# Altium project PROJ4.PrjPcb
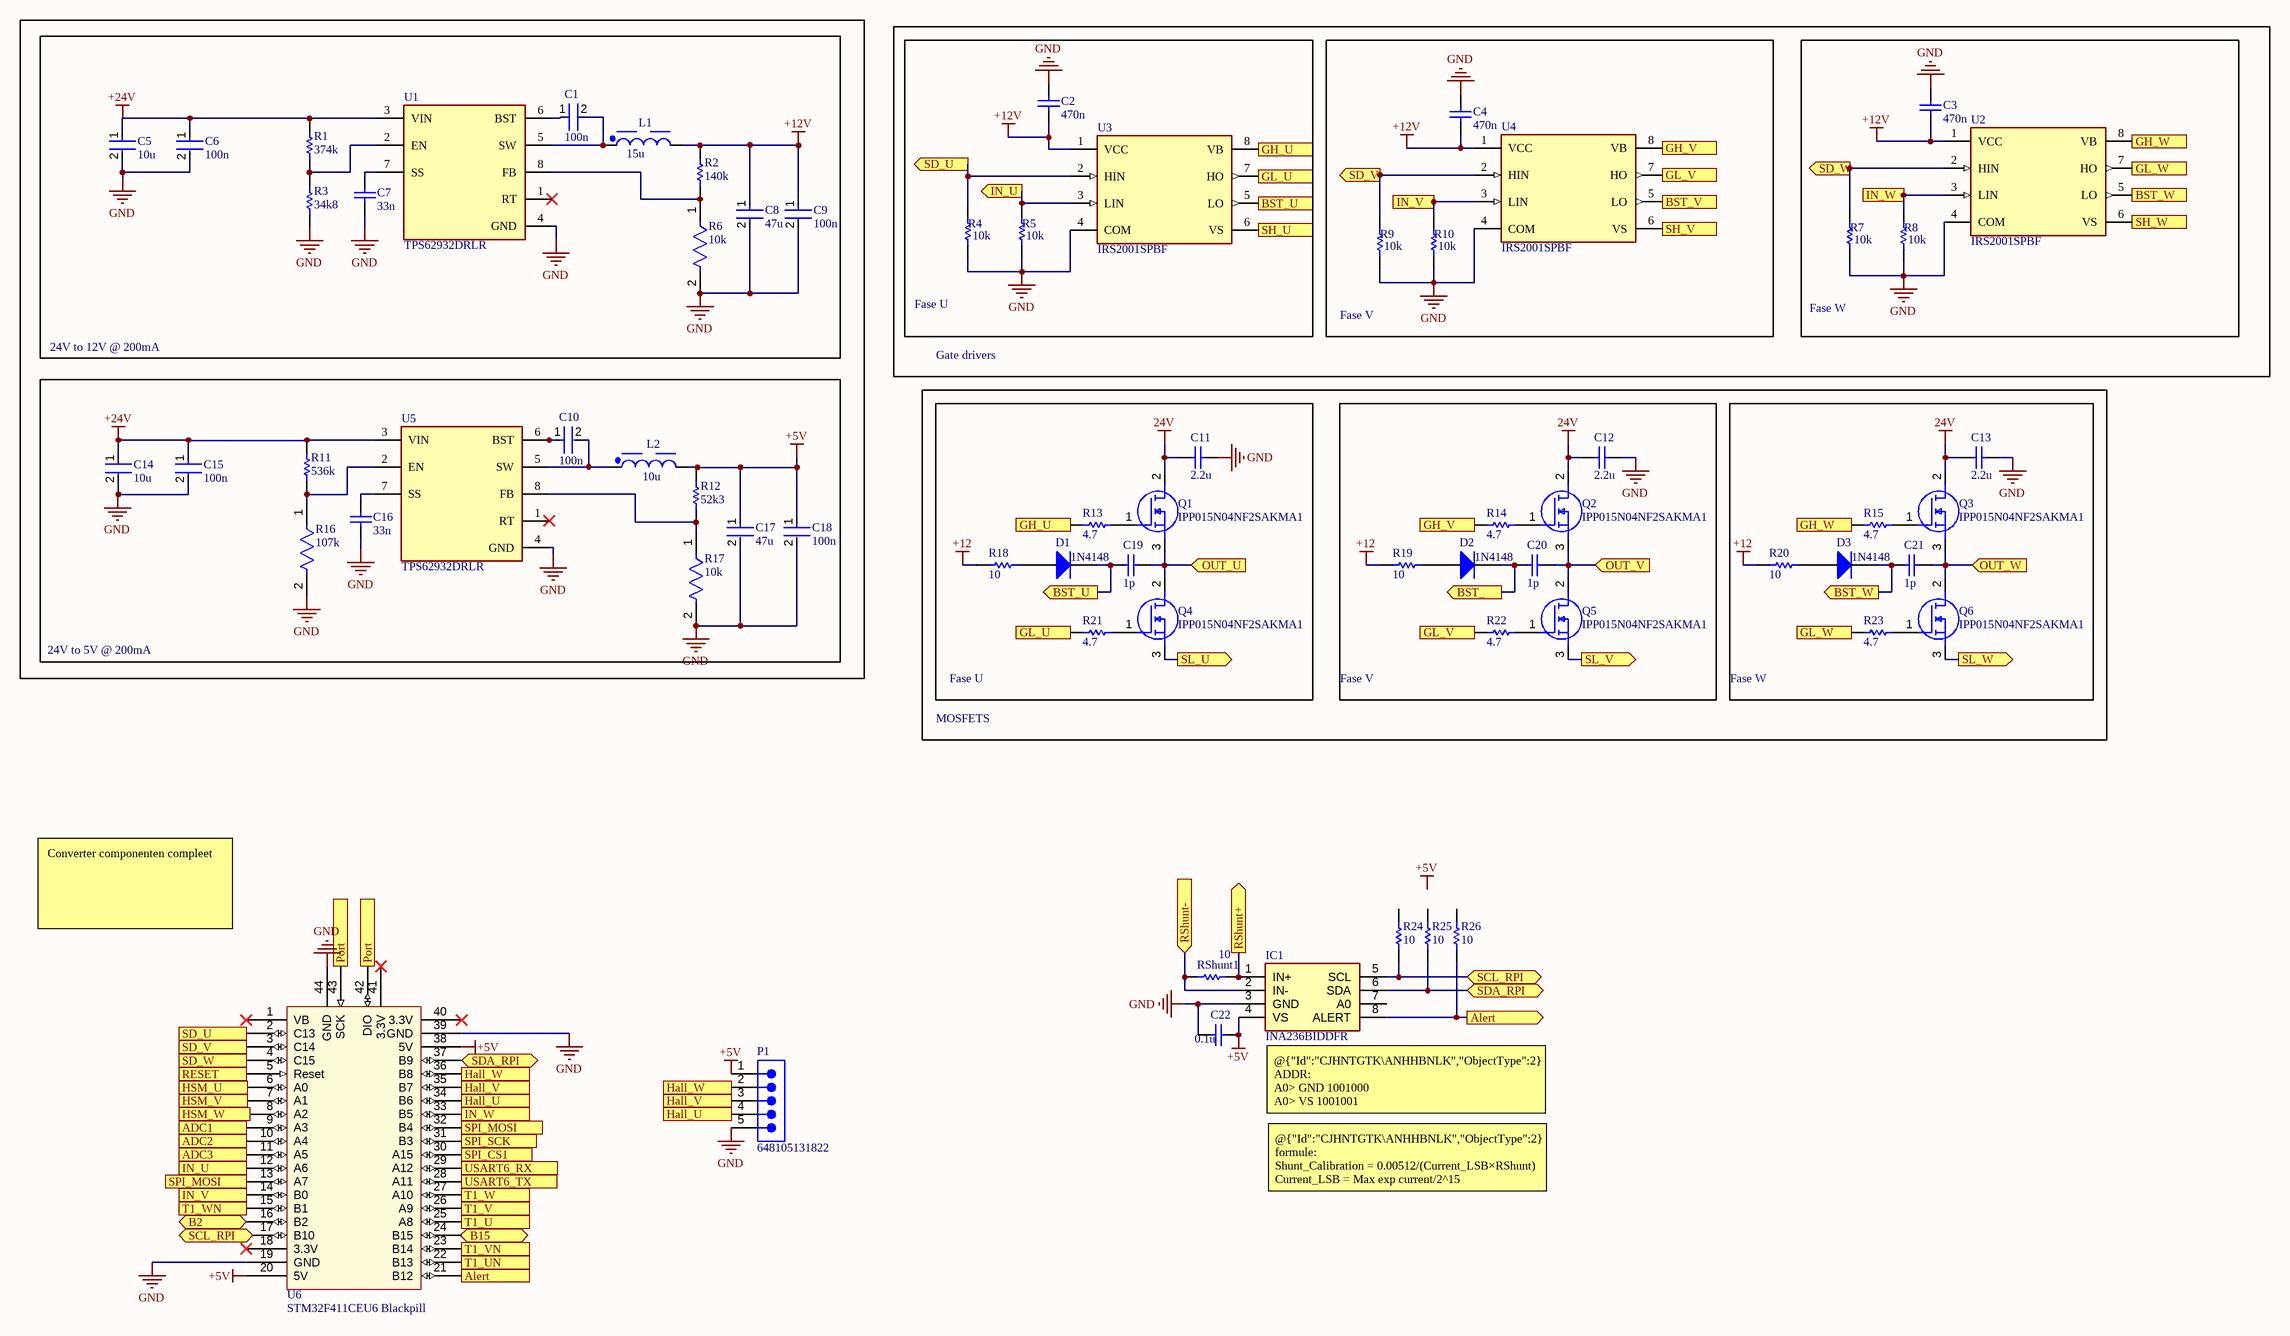
[diagram p0: Sheet1.SchDoc]
CAGE_CODE: ?????; CONTRACT_NUMBER: <CONTRACT NO>; DOC_NO_ASSY_DWG: <ASSY DWG NO>; DOC_NO_BOM: <BOM DOC NO>; DOC_NO_FAB_DWG: <FAB DWG NO>; DOC_NO_SCH_DWG: <SCH DWG NO>; PCB_2_DEC_TOL: +/-.01; PCB_3_DEC_TOL: +/-.010; PCB_ANG_TOL: +/-1/2; PCB_ASSEMBLY_NO: <PCB ASSY NO>; PCB_CHECKER: - -----; PCB_CHECKER_APP_DATE: --/--/----; PCB_DESIGNER: - -----; PCB_DESIGNER_APP_DATE: --/--/----; PCB_DWG_NO: <PCB DWG NO>; PCB_ENGINEER: - -----; PCB_ENGINEER_APP_DATE: --/--/----; PCB_PART_NUMBER: <PCB PN>; PCB_REV: A; SCH_REV: A
1 sheet, 68 parts. Net scope: flat (ports and power ports of the same name join across sheets).
Board file: PCB1.PcbDoc

## Sheet Sheet1.SchDoc: E-Bike controller
size C; Author: Laurens van der Drift; CompanyName: ALSET Innovations; DrawnBy: Laurens van der Drift; Engineer: Luuk van Kappel; Organization: De Haagse Hogeschool; SheetNumber: 1; SheetTotal: 1; ENG_APP_DATE: --/--/--; DSN_APP_DATE: --/--/--; CHK_APP_DATE: --/--/--

### Parts
C1  100n  [FP-CGA3E-0_3-0_1-IPC_A]
C2  value 470n  (hidden comment: Capacitor)
C3  value 470n  (hidden comment: Capacitor)
C4  value 470n  (hidden comment: Capacitor)
C5  10u  [FP-C3216-160-0_2-IPC_A]
C6  100n  [FP-CGA3E-0_3-0_1-IPC_A]
C7  33n  [CAPC1005X55X25NL05T10]
C8  47u  [FP-GRM32E-0_3-0_2-IPC_C]
C9  100n  [FP-CGA3E-0_3-0_1-IPC_A]
C10  100n  [FP-CGA3E-0_3-0_1-IPC_A]
C11  value 2.2u  (hidden comment: Capacitor)
C12  value 2.2u  (hidden comment: Capacitor)
C13  value 2.2u  (hidden comment: Capacitor)
C14  10u  [FP-C3216-160-0_2-IPC_A]
C15  100n  [FP-CGA3E-0_3-0_1-IPC_A]
C16  33n  [CAPC1005X55X25NL05T10]
C17  47u  [FP-GRM32E-0_3-0_2-IPC_C]
C18  100n  [FP-CGA3E-0_3-0_1-IPC_A]
C19  value 1p  (hidden comment: Capacitor)
C20  value 1p  (hidden comment: Capacitor)
C21  value 1p  (hidden comment: Capacitor)
C22  value 0.1u  (hidden comment: Capacitor)
D1  1N4148  [NXP-SOD27-2_V]
D2  1N4148  [NXP-SOD27-2_V]
D3  1N4148  [NXP-SOD27-2_V]
IC1  INA236BIDDFR  [SOT65P280X110-8N]
L1  15u  [WE-PD_1210]
L2  10u  [WE-PD_1210]
P1  648105131822  [648105131822]
Q1  IPP015N04NF2SAKMA1  [TO254P475X1028X1996-3P]
Q2  IPP015N04NF2SAKMA1  [TO254P475X1028X1996-3P]
Q3  IPP015N04NF2SAKMA1  [TO254P475X1028X1996-3P]
Q4  IPP015N04NF2SAKMA1  [TO254P475X1028X1996-3P]
Q5  IPP015N04NF2SAKMA1  [TO254P475X1028X1996-3P]
Q6  IPP015N04NF2SAKMA1  [TO254P475X1028X1996-3P]
R1  374k  [RESC1005X40X25ML05T05]
R2  140k  [RESC1609X50X30LL10T20]
R3  34k8  [RESC1005X40X25ML05T05]
R4  value 10k  (hidden comment: Resistor)
R5  value 10k  (hidden comment: Resistor)
R6  10k  [FP-CRCW0402-e3-IPC_B]
R7  value 10k  (hidden comment: Resistor)
R8  value 10k  (hidden comment: Resistor)
R9  value 10k  (hidden comment: Resistor)
R10  value 10k  (hidden comment: Resistor)
R11  536k  [RESC1005X40X25LL05T05]
R12  52k3  [RESC1608X55X25LL10T15]
R13  value 4.7  (hidden comment: Resistor)
R14  value 4.7  (hidden comment: Resistor)
R15  value 4.7  (hidden comment: Resistor)
R16  107k  [FP-CRCW0402-e3-IPC_A]
R17  10k  [FP-CRCW0402-e3-IPC_B]
R18  value 10  (hidden comment: Resistor)
R19  value 10  (hidden comment: Resistor)
R20  value 10  (hidden comment: Resistor)
R21  value 4.7  (hidden comment: Resistor)
R22  value 4.7  (hidden comment: Resistor)
R23  value 4.7  (hidden comment: Resistor)
R24  value 10  (hidden comment: Resistor)
R25  value 10  (hidden comment: Resistor)
R26  value 10  (hidden comment: Resistor)
RShunt1  value 10  (hidden comment: Resistor)
U1  TPS62932DRLR  [FP-DRL0008A-MFG]
U2  IRS2001SPBF  [FP-PG-DSO-8-MFG]
U3  IRS2001SPBF  [FP-PG-DSO-8-MFG]
U4  IRS2001SPBF  [FP-PG-DSO-8-MFG]
U5  TPS62932DRLR  [FP-DRL0008A-MFG]
U6  STM32F411CEU6 Blackpill  [STM32F411CEU6 Blackpill-Footprint-1]

### Blocks framed on the sheet
24V to 12V @ 200mA: C1 C5-C9 L1 R1-R3 R6 U1
Fase U: C2 R4 R5 U3
Fase V: C4 R9 R10 U4
Fase W: C3 R7 R8 U2
24V to 5V @ 200mA: C10 C14-C18 L2 R11 R12 R16 R17 U5
Fase U: C11 C19 D1 Q1 Q4 R13 R18 R21
Fase V: C12 C20 D2 Q2 Q5 R14 R19 R22
Fase W: C13 C21 D3 Q3 Q6 R15 R20 R23

### Ports
ADC1 (in), ADC2 (in), ADC3, Alert (in), Alert (out), B2 (bidir), B15 (bidir), BST_ (out), BST_U (out), BST_V (out), BST_W (out), GH_U (in), GH_U (out), GH_V (in), GH_V (out), GH_W (in), GH_W (out), GL_U (in), GL_U (out), GL_V (in), GL_V (out), GL_W (in), GL_W (out), Hall_U (in), Hall_U (out), Hall_V (in), Hall_V (out), Hall_W (in), Hall_W (out), HSM_U (in), HSM_V (in), HSM_W (in), IN_U (out), IN_V (out), IN_W (out), OUT_U (in), OUT_V (in), OUT_W (in), Port, RESET (in), RShunt+ (out), RShunt- (in), SCL_RPI (bidir), SD_U (out), SD_V (out), SD_W (out), SDA_RPI (bidir), SH_U (in), SH_V (in), SH_W (in), SL_U (out), SL_V (out), SL_W (out), SPI_CS1 (out), SPI_MOSI (in), SPI_MOSI (out), SPI_SCK (out), T1_U (out), T1_UN (out), T1_V (out), T1_VN (out), T1_W (out), T1_WN (out), USART6_RX (in), USART6_TX (out)

### Nets
24V: C11.1 C12.1 C13.1 Q1.2(D) Q2.2(D) Q3.2(D)
+5V: C17.1 C18.1 C22.2 IC1.4(VS) L2.2 P1.1 R12.2 U6.20(5V) U6.38(5V)
+12: R18.1 R19.1 R20.1
+12V: C2.2 C3.2 C4.2 C8.1 C9.1 L1.2 R2.1 U2.1(VCC) U3.1(VCC) U4.1(VCC)
+24V: C5.1 C6.1 C14.1 C15.1 R1.2 R11.2 U1.3(VIN) U5.3(VIN)
GND: C2.1 C3.1 C4.1 C5.2 C6.2 C7.1 C8.2 C9.2 C11.2 C12.2 C13.2 C14.2 C15.2 C16.1 C17.2 C18.2 C22.1 IC1.3(GND) P1.5 R3.1 R4.1 R5.1 R6.2 R7.1 R8.1 R9.1 R10.1 R16.2 R17.2 U1.4(GND) U2.4(COM) U3.4(COM) U4.4(COM) U5.4(GND) U6.19(GND) U6.39(GND) U6.44(GND)
NetC1_1: C1.1 U1.6(BST)
NetC1_2: C1.2 L1.1 U1.5(SW)
NetC7_2: C7.2 U1.7(SS)
NetC10_1: C10.1 U5.6(BST)
NetC10_2: C10.2 L2.1 U5.5(SW)
NetC16_2: C16.2 U5.7(SS)
NetC19_1: C19.1 D1.2(K) U3.5(LO) ; port BST_U
NetC19_2: C19.2 Q1.3(S) Q4.2(D) ; port OUT_U
NetC20_1: C20.1 D2.2(K) ; port BST_
NetC20_2: C20.2 Q2.3(S) Q5.2(D) ; port OUT_V
NetC21_1: C21.1 D3.2(K) U2.5(LO) ; port BST_W
NetC21_2: C21.2 Q3.3(S) Q6.2(D) ; port OUT_W
NetD1_1: D1.1(A) R18.2
NetD2_1: D2.1(A) R19.2
NetD3_1: D3.1(A) R20.2
NetIC1_1: IC1.1(IN+) RShunt1.1 ; port RShunt+
NetIC1_2: IC1.2(IN-) RShunt1.2 ; port RShunt-
NetIC1_5: IC1.5(SCL) R24.1 ; port SCL_RPI
NetIC1_6: IC1.6(SDA) R25.1 U6.37(B9) ; port SDA_RPI
NetIC1_8: IC1.8(ALERT) R26.1 U6.21(B12) ; port Alert
NetP1_2: P1.2 U6.36(B8) ; port Hall_W
NetP1_3: P1.3 U6.35(B7) ; port Hall_V
NetP1_4: P1.4 U6.34(B6) ; port Hall_U
NetQ1_1: Q1.1(G) R13.2
NetQ2_1: Q2.1(G) R14.2
NetQ3_1: Q3.1(G) R15.2
NetQ4_1: Q4.1(G) R21.2
NetQ4_3: Q4.3(S) ; port SL_U
NetQ5_1: Q5.1(G) R22.2
NetQ5_3: Q5.3(S) ; port SL_V
NetQ6_1: Q6.1(G) R23.2
NetQ6_3: Q6.3(S) ; port SL_W
NetR1_1: R1.1 R3.2 U1.2(EN)
NetR2_2: R2.2 R6.1 U1.8(FB)
NetR4_2: R4.2 U3.2(HIN) U6.2(C13) ; port SD_U
NetR5_2: R5.2 U3.3(LIN) U6.12(A6) ; port IN_U
NetR7_2: R7.2 U2.2(HIN) U6.4(C15) ; port SD_W
NetR8_2: R8.2 U2.3(LIN) U6.33(B5) ; port IN_W
NetR9_2: R9.2 U4.2(HIN) U6.3(C14) ; port SD_V
NetR10_2: R10.2 U4.3(LIN) U6.14(B0) ; port IN_V
NetR11_1: R11.1 R16.1 U5.2(EN)
NetR12_1: R12.1 R17.1 U5.8(FB)
NetR13_1: R13.1 U3.8(VB) ; port GH_U
NetR14_1: R14.1 U4.8(VB) ; port GH_V
NetR15_1: R15.1 U2.8(VB) ; port GH_W
NetR21_1: R21.1 U3.7(HO) ; port GL_U
NetR22_1: R22.1 U4.7(HO) ; port GL_V
NetR23_1: R23.1 U2.7(HO) ; port GL_W
NetU2_6: U2.6(VS) ; port SH_W
NetU3_6: U3.6(VS) ; port SH_U
NetU4_5: U4.5(LO) ; port BST_V
NetU4_6: U4.6(VS) ; port SH_V
NetU6_5: U6.5(Reset) ; port RESET
NetU6_9: U6.9(A3) ; port ADC1
NetU6_10: U6.10(A4) ; port ADC2
NetU6_11: U6.11(A5) ; port ADC3
NetU6_13: U6.13(A7) U6.32(B4) ; port SPI_MOSI
NetU6_15: U6.15(B1) ; port T1_WN
NetU6_16: U6.16(B2) ; port B2
NetU6_22: U6.22(B13) ; port T1_UN
NetU6_23: U6.23(B14) ; port T1_VN
NetU6_24: U6.24(B15) ; port B15
NetU6_25: U6.25(A8) ; port T1_U
NetU6_26: U6.26(A9) ; port T1_V
NetU6_27: U6.27(A10) ; port T1_W
NetU6_28: U6.28(A11) ; port USART6_TX
NetU6_29: U6.29(A12) ; port USART6_RX
NetU6_30: U6.30(A15) ; port SPI_CS1
NetU6_31: U6.31(B3) ; port SPI_SCK
NetU6_42: U6.42(DIO) U6.43(SCK) ; port Port

Not connected (* = marked no-connect by the designer): IC1 7(A0); R24 2; R25 2; R26 2; U1 1(RT)*; U5 1(RT)*; U6 1(VB)* 6(A0) 7(A1) 8(A2) 17(B10) 18(3.3V)* 40(3.3V)* 41(3.3V)*

### Notes on the sheet
- Gate drivers
- MOSFETS
- Converter componenten compleet
- @{"Id":"CJHNTGTK\ANHHBNLK","ObjectType":2} ADDR:
  A0> GND 1001000
  A0> VS 1001001
  A0> SDA 1001010
  A0> SCL 1001011
- @{"Id":"CJHNTGTK\ANHHBNLK","ObjectType":2} formule:
  Shunt_Calibration = 0.00512/(Current_LSB×RShunt)
  Current_LSB = Max exp current/2^15
  RShunt < Vsense_MAX/Imax
- Labels drawn without touching a wire or pin: +5V
- DWG. NO.
- REV.
- SHT.
- THIS DOCUMENT AND THE DATA DISCLOSED HEREIN OR HEREWITH IS THE PROPERTY OF ALTIUM LIMITED AND MAY BE FREELY DISTRIBUTED IN WHOLE. NO RIGHTS ARE RESERVED OR EXPRESS OR IMPLIED WARANTEE GIVEN.
- REVISION
- DESCRIPTION
- DATE
- APPROVED
- ENG:
- APPROVALS
- PROJECT
- DSN:
- CHK:
- REFERENCE DOCUMENTS
- PROJECT REVISION:
- TITLE
- DOCUMENT REVISION:
- DESIGN ITEM:
- BOM:
- FAB DWG:
- PCB DWG:
- ASSY DWG:
- SCALE:
- SIZE
- B
- CAGE CODE
- FILE NAME
- DWG NO.
- SHEET
- OF
- REV

### Library data of the parts
C1 C6 C9 C10 C15 C18 = CMP-2000-07546-2: Cap Ceramic 100nF 50V X7R 10% Pad SMD 0603 +125°C Automotive T/R / Fabrikantnr: CGA3E2X7R1H104K080AA; Weight: 7.1E-05oz; Composition: Ceramic; Max Operating Temperature: 125°C; Termination: SMD/SMT; Dielectric: X7R; Length: 1.6mm; Package Quantity: 1; REACH SVHC: No SVHC; Lead Free: Lead Free; Case Code (Metric): 1608; Min Operating Temperature: -55°C; Packaging: Tape and Reel; Tolerance: 10%; Voltage Rating: 50V; Case Code (Imperial): 0603; Capacitance: 100nF; Case/Package: 0603; Voltage Rating (DC): 50V; Depth: 0.8mm; Radiation Hardening: No; Ratings: AEC-Q200; Mount: Surface Mount; Voltage: 50V; Thickness: 0.035inch; Width: 0.8mm; Height: 0.8mm
C2-C4 C11-C13 C19-C22 = Capacitor: SimulationGenericComponent: True
C5 C14 = CMP-2000-06045-2: Multilayer Ceramic Capacitors 10uF ±10% 50V X5R SMD 1206 / Mouser Fabrikantnr: C3216X5R1H106K160AB; Min Operating Temperature: -55°C; Weight: 0.000571oz; Tolerance: 10%; Lead Free: Lead Free; REACH SVHC: No SVHC; Dielectric Material: Ceramic; Termination: SMD/SMT; Radiation Hardening: No; Case Code (Metric): 3216; Max Operating Temperature: 85°C; Voltage Rating (DC): 50V; Packaging: Tape and Reel; Height: 1.6mm; Voltage: 50V; Dielectric: X5R; Mount: Surface Mount; Voltage Rating: 50V; Capacitance: 10uF; Length: 3.2mm; RoHS Compliant: Yes; Thickness: 0.071inch; Depth: 1.6mm; Width: 0.063inch; Case/Package: 1206; Series: C; Package Quantity: 1; Resistor Type: Ceramic; Case Code (Imperial): 1206; Construction: Flat
C7 C16 = CMP-1034-01988-2: 33nF, 25VDC / Mouser Fabrikantnr: GRM155R71E333KA88D; Manufacturer: Murata; Part Number: GRM155R71E333KA88D
C8 C17 = CMP-2000-06362-2: CAP CER 47UF 16V X5R 1210 / Fabrikantnr: GRM32ER61C476KE15L; Tolerance: 10%; Material: Ceramic; Case Code (Metric): 3225; RoHS Compliant: Yes; Min Operating Temperature: -55°C; Radiation Hardening: No; Voltage: 16V; Package Quantity: 1; Case Code (Imperial): 1210; REACH SVHC: No SVHC; Capacitance: 47uF; Voltage Rating (DC): 16V; Dielectric: X5R; Case/Package: 1210; Length: 3.2mm; Voltage Rating: 16V; Packaging: Cut Tape; Width: 0.098inch; Number of Pins: 2; Lead Free: Lead Free; Height: 2.5mm; Mount: Surface Mount; Termination: SMD/SMT; Max Operating Temperature: 85°C; Thickness: 0.106inch; Depth: 2.5mm
D1-D3 = CMP-004-00000-2: High Speed Diode, 100 V, 0.45 A, -65 to 175 degC, 2-Pin SOD27, RoHS, Bulk; Manufacturer: Fairchild; Elements: 1; Recovery Time: 4ns; Forward Current: 300mA; Power: 500mW; Forward Voltage: 1V; Max Surge Current: 4A; Peak Reverse Current: 5uA; Datasheet URL: http://www.nxp.com/documents/data_sheet/1N4148_1N4448.pdf; Min Operating Temperature: -65°C; Manufacturer URL: https://www.fairchildsemi.com/; Packaging: Bulk; Diameter: 1.91mm; Pins: 2; Package URL: http://www.nxp.com/documents/data_sheet/1N4148_1N4448.pdf; Package Reference: SOD27; Max Operating Temperature: 175°C; Package Quantity: 2000; Case/Package: DO; Datasheet Version: Aug-04; RoHS Compliant: True
IC1 = INA236BIDDFR: Integrated Circuit; Manufacturer_Name: Texas Instruments; Datasheet Link: https://www.ti.com/general/docs/suppproductinfo.tsp?distId=26&gotoUrl=https://www.ti.com/lit/gpn/ina236; Height: 1.1mm; Manufacturer_Part_Number: INA236BIDDFR; Mouser Part Number: 595-INA236BIDDFR; Mouser Price/Stock: https://www.mouser.co.uk/ProductDetail/Texas-Instruments/INA236BIDDFR?qs=17ckDYBRdelpXu8anct71w%3D%3D
L1 = CMP-0227-00106-2: Vermogensinductoren - SMD WE-PD 15uH 6.5A / Mosuer Fabrikantnr: 7447709150; NexarPartId: 8917162; Series Resistance: 26mΩ; Inductance: 15µH; Test Frequency: 1kHz; Core Material: Ferrite; Tolerance: 20%; Shielding: Shielded; Self Resonant Frequency: 17MHz; DC Resistance (DCR): 21mΩ; Saturation Current: 8A; Case/Package: Nonstandard; Max DC Current: 6.5A; Composition: Wirewound; Case Code (Imperial): 1210; Width: 12mm; Termination: SMD/SMT; Resistance: 26mΩ; Max Operating Temperature: 125°C; Weight: 9.071847g; Min Operating Temperature: -40°C; Current Rating: 6.5A; Lead Free: Lead Free; Depth: 12mm; Mount: Surface Mount; Height - Seated (Max): 10.0076mm; Packaging: Cut Tape (CT); Case Code (Metric): 3225; Length: 12mm; Ambient Temperature Range High: 85°C; REACH SVHC: Unknown; Ambient Temperature Range Low: -40°C; Lead Pitch: 7mm; RoHS: Compliant; Number of Pins: 2; Inductance Tolerance: 20%; Height: 10mm; RMS Current (Irms): 6.5A
L2 = CMP-0227-00034-2: Vermogensinductoren - SMD WE-PD 10uH 7.1A / Fabrikantnr: 7447709100; NexarPartId: 21642419; Core Material: Ferrite; DC Resistance (DCR): 13mΩ; Test Frequency: 1kHz; Series Resistance: 21mΩ; Inductance: 10µH; Tolerance: 20%; Saturation Current: 10.5A; Self Resonant Frequency: 21MHz; Shielding: Shielded; Ambient Temperature Range Low: -40°C; Number of Pins: 2; Height - Seated (Max): 10.0076mm; Length: 12mm; Max Operating Temperature: 125°C; Max DC Current: 7.1A; Width: 12mm; Case Code (Metric): 3225; Composition: Wirewound; REACH SVHC: Unknown; Case/Package: Nonstandard; Packaging: Tape & Reel (TR); RoHS: Compliant; Current Rating: 7.1A; Min Operating Temperature: -40°C; Resistance: 21mΩ; Inductance Tolerance: 20%; Lead Pitch: 7mm; Case Code (Imperial): 1210; Height: 10mm; Ambient Temperature Range High: 85°C; Mount: Surface Mount; Weight: 4.535924g; Lead Free: Lead Free; Depth: 12mm; Termination: SMD/SMT; RMS Current (Irms): 7.1A
P1 = CMP-1502-00733-2: NexarPartId: 18818254; Number of Contacts: 5; Voltage Rating: 50V; Current Rating: 1A; Contact Resistance: 20mΩ; Gender: Male; Insulation Resistance: 500MΩ; Connector Type: Male Pin; Pitch: 1.5mm; Color: Beige, White; Number of Positions: 5; Lead Pitch: 1.5mm; Mount: Surface Mount; Contact Gender: Male; Contact Material: Copper; Flammability Rating: UL94 V-0; RoHS: Compliant; Packaging: Tape and Reel; REACH SVHC: Unknown; Housing Material: Nylon; Contact Plating: Tin; Height: 3.7mm; Max Operating Temperature: 85°C; Operating Supply Voltage: 50V; Number of Pins: 5; Termination: Solder; Min Operating Temperature: -25°C; Number of Rows: 1; Width: 10.5mm; Length: 10.5mm
Q1-Q6 = IPP015N04NF2SAKMA1: MOSFET (N-Channel); Manufacturer_Name: Infineon; Datasheet Link: https://www.mouser.it/datasheet/2/196/Infineon_IPP015N04NF2S_DataSheet_v02_00_EN-3164869.pdf; Height: 4.75mm; Manufacturer_Part_Number: IPP015N04NF2SAKMA1; Mouser Part Number: 726-IPP015N04NF2SAKM; Mouser Price/Stock: https://www.mouser.co.uk/ProductDetail/Infineon-Technologies/IPP015N04NF2SAKMA1?qs=By6Nw2ByBD2rHCf0vCszHQ%3D%3D; Arrow Part Number: IPP015N04NF2SAKMA1; Arrow Price/Stock: https://www.arrow.com/en/products/ipp015n04nf2sakma1/infineon-technologies-ag?region=nac
R1 = CMP-2002-08555-1: 374k / Fabrikantnr: / CRCW0402374KFKED; Manufacturer: Vishay Dale; Part Number: CRCW0402374KFKED
R2 = CMP-2000-03900-1: Mosuer Fabrikantnr: CRCW0603140KFKEA; Manufacturer: Vishay Dale; Part Number: CRCW0603140KFKEA
R3 = CMP-1011-00683-2: 34k8 / Fabrikantnr: / CRCW040234K8FKED; Manufacturer: Vishay Dale; Part Number: CRCW040234K8FKED
R4 R5 R7-R10 R13-R15 R18-R26 RShunt1 = Resistor: TC1: 0; SimulationGenericComponent: True; TC2: 0
R6 R17 = CMP-2002-08135-2: RES SMD 10K OHM 1% 1/16W 0402 / Fabrikantnr: CRCW040210K0FKED; Power Rating: 63mW; Resistance: 10kR; Voltage Rating: 50V; Temperature Coefficient: 100ppm/°C; Case Code (Metric): 1005; Features: Automotive AEC-Q200; Termination: SMD/SMT; Mount: Surface Mount; Package Quantity: 10; Packaging: Tape and Reel; Case Code (Imperial): 0402; Weight: 2.3E-05oz; Lead Free: Lead Free; Width: 0.02inch; Max Power Dissipation: 63mW; Tolerance: 1%; Number of Terminations: 2; Height: 0.35mm; Number of Pins: 2; Composition: Thick Film; Length: 1mm; Voltage Rating (DC): 50V; Case/Package: 0402; Radiation Hardening: No; Contact Plating: Tin; Depth: 0.5mm; Military Standard: Not; Min Operating Temperature: -55°C; Max Operating Temperature: 155°C
R11 = CMP-1011-00819-2: 536kohm / Mouser Fabrikantnr: CRCW0402536KFKED / CRCW0402536KFKED; Manufacturer: Vishay Dale; Part Number: CRCW0402536KFKED
R12 = CMP-1012-00705-2: Mouser Fabrikantnr: RC0603FR-0752K3L; Manufacturer: Yageo; Part Number: RC0603FR-0752K3L
R16 = CMP-2002-08133-2: RES Thick Film, 107kΩ, 1%, 0.063W, 100ppm/°C, 0402 / Fabrikantnr: / CRCW0402107KFKED; Max Power Dissipation: 63mW; Voltage Rating (DC): 50V; Resistance: 107kR; Case Code (Imperial): 0402; Features: Automotive AEC-Q200; Lead Free: Lead Free; Radiation Hardening: No; Case/Package: 0402; Max Operating Temperature: 155°C; Case Code (Metric): 1005; Depth: 0.5mm; Number of Terminations: 2; Temperature Coefficient: 100ppm/°C; Contact Plating: Tin; Height: 0.016inch; Tolerance: 1%; Weight: 2.3E-05oz; Min Operating Temperature: -55°C; Power Rating: 63mW; Packaging: Tape and Reel; Termination: SMD/SMT; Package Quantity: 10; Width: 0.02inch; Length: 1mm; Composition: Thick Film; Military Standard: Not; Number of Pins: 2; Voltage Rating: 50V
U1 U5 = CMP-04918-000714-1: 3.8-V TO 30-V INPUT, 2-A, 200-KH
U2-U4 = CMP-00196-65875172-1: IRS2001SPBF Cut Tape (CT) IRS2001SPBF Half-Bridge 1996 gate driver 100ns -40C~150C TJ 290mA 600mA 625mW; Channel Type: Independent; Operating Supply Current: 270µA; Turn-Off Delay Time: 150ns; Fall Time: 35ns; Number of Outputs: 2; Output Voltage: 220V; Nominal Supply Current: 150µA; Rise Time: 170ns; Propagation Delay: 220ns; Output Current: 130mA; Max Supply Voltage: 20V; Turn-On Delay Time: 160ns; Max Junction Temperature (Tj): 150°C; Min Supply Voltage: 10V; Mount: Surface Mount, Through Hole; Max Operating Temperature: 125°C; RoHS: Compliant; Ambient Temperature Range High: 125°C; Min Operating Temperature: -40°C; NexarPartId: 65875172; Number of Pins: 8; Lifecycle Status: NRND; Height: 1.4986mm; Package Quantity: 2500; Lead Free: Lead Free; Release Time: 150ns; Schedule B: 8542390000, 8542390000; Power Dissipation: 625mW; REACH SVHC: No SVHC; Width: 3.9878mm; Number of Channels: 2; Case/Package: DIP; Max Power Dissipation: 625mW; Weight: 540.001716mg; Number of Drivers: 2; Length: 4.9784mm; Max Supply Current: 270µA; Max Output Current: 600mA; Radiation Hardening: No; Packaging: Tape & Reel
U6 = CMP-005-000000-4: This simple development board for the STM32F411 is a great way to add a powerful STM chip to your next project.; Clock Frequency: 32.768kHz; Min Supply Voltage: 2V; Power: 549mW; RAM Size: 64KiB; Frequency: 72MHz; Max Supply Voltage: 6V; Nominal Supply Voltage: 3.3V; I/Os: 48 pins; Pins: 48; Mounting Technology: THT; Source: Components - 24.03.24 - 20.50.SchLib; Design Item ID: CMP-020-00023-3